# EAGLE schematic mini32 (EAGLE 7.2.0)
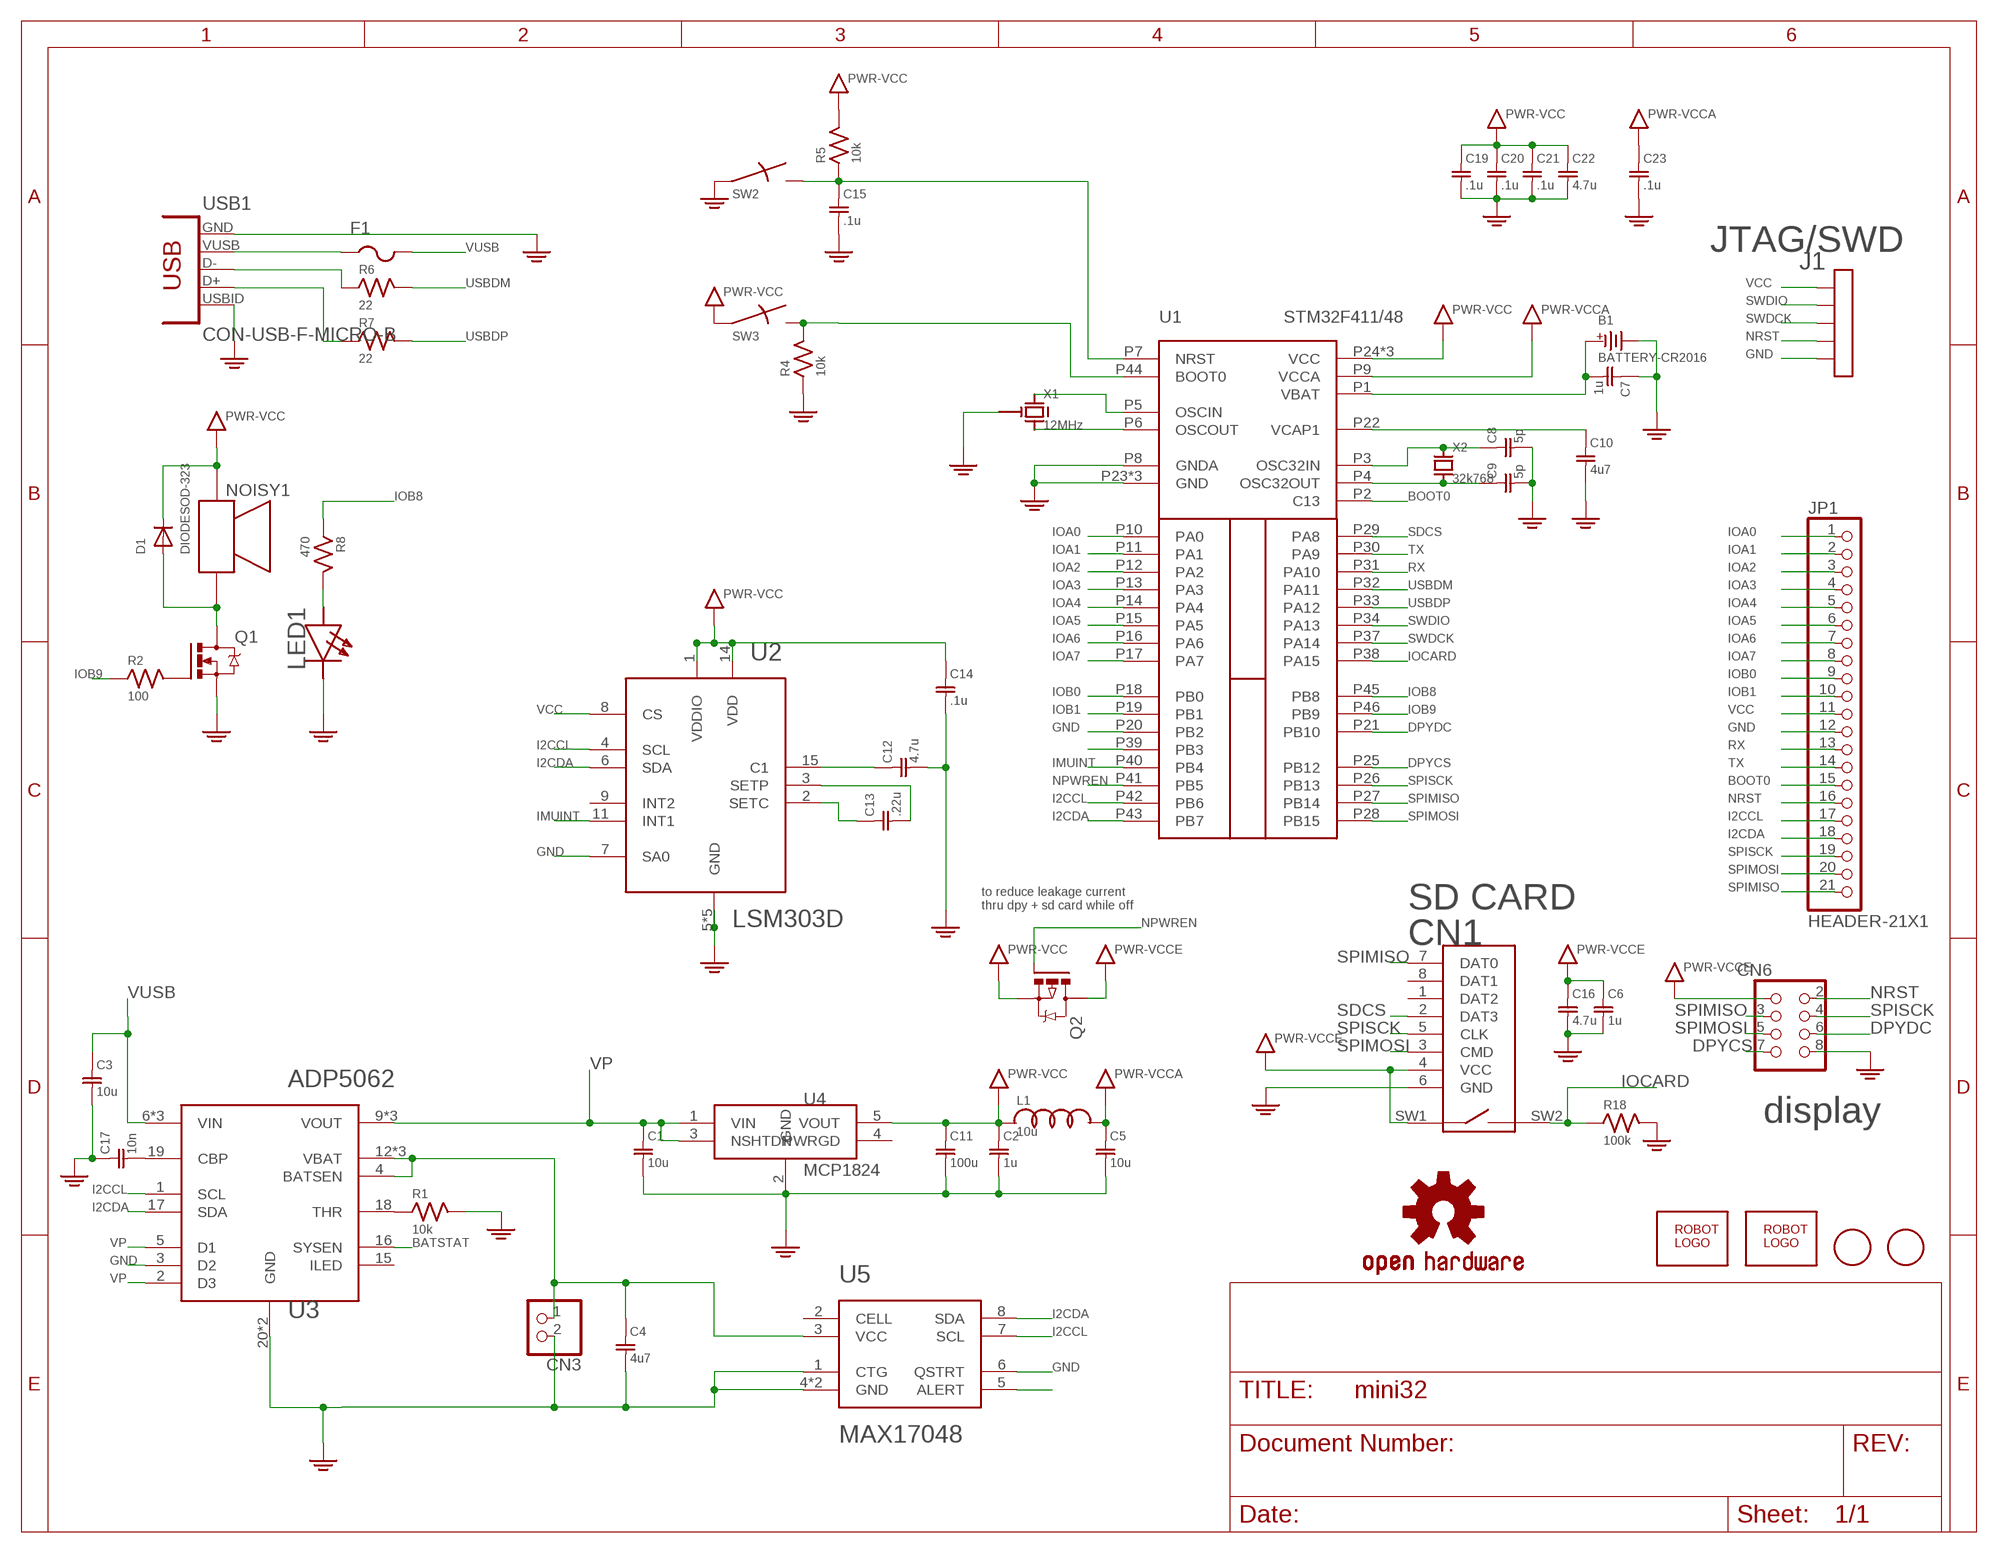
[diagram p0: schematic, sheet 1]

## Parts
B1  BATTERY-CR2016  [CR1216]
C1  10u  C0603  [SMD0603]
C2  1u  C0603  [SMD0603]
C3  10u  C0603  [SMD0603]
C4  4u7  C0603  [SMD0603]
C5  10u  C0603  [SMD0603]
C6  1u  C0603  [SMD0603]
C7  1u  C0603  [SMD0603]
C8  5p  C0603  [SMD0603]
C9  5p  C0603  [SMD0603]
C10  4u7  C0603  [SMD0603]
C11  100u  C1210  [SMD1210]
C12  4.7u  C0603  [SMD0603]
C13  .22u  C0603  [SMD0603]
C14  .1u  C0603  [SMD0603]
C15  .1u  C0603  [SMD0603]
C16  4.7u  C0603  [SMD0603]
C17  10n  C0603  [SMD0603]
C19  .1u  C0603  [SMD0603]
C20  .1u  C0603  [SMD0603]
C21  .1u  C0603  [SMD0603]
C22  4.7u  C0603  [SMD0603]
C23  .1u  C0603  [SMD0603]
CN1  MICROSDPLAIN  [MICROSD/MOLEX/FRONT/PLAIN]
CN3  JST_2PIN-SMT-RA  [JST-PH-2-SMT-RA]
CN6  HEADER-2X4  [HEADER-2X04]
D1  DIODESOD-323  [SOD-323]
F1  PTCFUSE-1206  [R1206]
J1  HEADER-5X1  [M127-5X1]
JP1  HEADER-21X1  [HEADER-21X1-PTH]
L1  10u  LSMD0603  [SMD0603]
LED1  white  LED  [SMD0603D]
LOGO1  OSHW-LOGOM  [OSHW-LOGO-M]
NOISY1  PUI-5040  [PUI-0540]
Q1  IRLML6344TRPBF  MOSFETSOT-23  [SOT-23]
Q2  DMP2035U-7  MOSFET-P  [SOT-23]
R1  10k  R0603  [SMD0603]
R2  100  R0603  [SMD0603]
R4  10k  R0603  [SMD0603]
R5  10k  R0603  [SMD0603]
R6  22  R0603  [SMD0603]
R7  22  R0603  [SMD0603]
R8  470  R0603  [SMD0603]
R18  100k  R0603  [SMD0603]
SW2  SWITCHKMR211  [KMR211]
SW3  SWITCHKMR211  [KMR211]
U1  STM32F411/48  [UQPFN48]
U2  LSM303D  [LGA16A]
U3  ADP5062  [LGA20P]
U4  MCP1824  [SOT-23-5]
U5  MAX17048  [TDFN8EP]
U$1  ROBOTMAN-LOGO2  [ROBOTMAN-LOGO2]
U$2  FIDUCIAL  [FIDUCIAL_1MM]
U$3  FIDUCIAL  [FIDUCIAL_1MM]
U$4  ROBOTMAN-LOGO2  [ROBOTMAN-LOGO2]
USB1  CON-USB-F-MICRO-B  [CONN_USB_MICRO-B]
X1  12MHz  RESONATORCTCE  [RESONATOR-CSTCE]
X2  32k768  XTAL32X15  [XTAL-32X15]

## Nets
BATSTAT: U3.16(SYSEN)
BOOT0: JP1.15 R4.2 SW3.2 SW3.4 U1.P2(C13) U1.P44(BOOT0)
DPYCS: CN6.7 U1.P25(PB12)
DPYDC: CN6.6 U1.P21(PB10)
GND: B1.MINUS(M) C1.2 C2.2 C3.2 C4.2 C5.2 C6.2 C7.1 C8.2 C9.2 C10.2 C11.2 C12.2 C14.2 C15.2 C16.2 C17.1 C19.2 C20.2 C21.2 C22.2 C23.2 CN1.6(GND) CN3.2 CN6.8 J1.P$5 JP1.12 LED1.C Q1.2(S) R1.2 R4.1 R18.2 SW2.1 SW2.3 U1.P8(GNDA) U1.P20(PB2) U1.P23(GND) U1.P35(GND) U1.P47(GND) U2.5(GND) U2.7(SA0) U2.10(GND) U2.12(GND) U2.13(GND) U2.16(GND) U3.3(D2) U3.20(GND) U3.PAD(GND) U4.2(GND) U5.1(CTG) U5.4(GND) U5.6(QSTRT) U5.PAD(GND) USB1.P4(USBID) USB1.P5(GND) X1.2(G) ; supply symbol labelled PWR-GND
I2CCL: JP1.17 U1.P42(PB6) U2.4(SCL) U3.1(SCL) U5.7(SCL)
I2CDA: JP1.18 U1.P43(PB7) U2.6(SDA) U3.17(SDA) U5.8(SDA)
IMUINT: U1.P40(PB4) U2.11(INT1)
IOA0: JP1.1 U1.P10(PA0)
IOA1: JP1.2 U1.P11(PA1)
IOA2: JP1.3 U1.P12(PA2)
IOA3: JP1.4 U1.P13(PA3)
IOA4: JP1.5 U1.P14(PA4)
IOA5: JP1.6 U1.P15(PA5)
IOA6: JP1.7 U1.P16(PA6)
IOA7: JP1.8 U1.P17(PA7)
IOB0: JP1.9 U1.P18(PB0)
IOB1: JP1.10 U1.P19(PB1)
IOB8: R8.1 U1.P45(PB8)
IOB9: R2.1 U1.P46(PB9)
IOCARD: CN1.SW2 R18.1 U1.P38(PA15)
N$1: C12.1 U2.15(C1)
N$2: C13.2 U2.3(SETP)
N$3: F1.1 USB1.P1(VUSB)
N$4: C13.1 U2.2(SETC)
N$5: C17.2 U3.19(CBP)
N$6: R1.1 U3.18(THR)
N$7: R6.1 USB1.P2(D-)
N$8: R7.1 USB1.P3(D+)
N$9: Q1.1(G) R2.2
N$11: LED1.A R8.2
N$12: U1.P5(OSCIN) X1.1(X1)
N$13: U1.P6(OSCOUT) X1.3(X2)
N$14: D1.A NOISY1.P2 Q1.3(D)
N$15: C8.1 U1.P3(OSC32IN) X2.P$1
N$16: C9.1 U1.P4(OSC32OUT) X2.P$2
N$18: C10.1 U1.P22(VCAP1)
N$21: B1.PLUS1(P) B1.PLUS2(P) C7.2 U1.P1(VBAT)
N$22: U5.5(ALERT)
NPWREN: Q2.1(G) U1.P41(PB5)
NRST: C15.1 CN6.2 J1.P$4 JP1.16 R5.1 SW2.2 SW2.4 U1.P7(NRST)
RX: JP1.13 U1.P31(PA10)
SDCS: CN1.2(DAT3) U1.P29(PA8)
SPIMISO: CN1.7(DAT0) CN6.3 JP1.21 U1.P27(PB14)
SPIMOSI: CN1.3(CMD) CN6.5 JP1.20 U1.P28(PB15)
SPISCK: CN1.5(CLK) CN6.4 JP1.19 U1.P26(PB13)
SWDCK: J1.P$3 U1.P37(PA14)
SWDIO: J1.P$2 U1.P34(PA13)
SWDWO: U1.P39(PB3)
TX: JP1.14 U1.P30(PA9)
USBDM: R6.2 U1.P32(PA11)
USBDP: R7.2 U1.P33(PA12)
VBAT: C4.1 CN3.1 U3.4(BATSEN) U3.12(VBAT) U3.13(VBAT) U3.14(VBAT) U5.3(VCC)
VCC: C2.1 C11.1 C14.1 C19.1 C20.1 C21.1 C22.1 D1.C J1.P$1 JP1.11 L1.1 NOISY1.P1 Q2.2(S) R5.2 SW3.1 SW3.3 U1.P24(VCC) U1.P36(VCC) U1.P48(VCC) U2.1(VDDIO) U2.8(CS) U2.14(VDD) U4.5(VOUT) ; supply symbol labelled PWR-VCC
VCCA: C5.1 C23.1 L1.2 U1.P9(VCCA) ; supply symbol labelled PWR-VCCA
VCCE: C6.1 C16.1 CN1.4(VCC) CN1.SW1 CN6.1 Q2.3(D) ; supply symbol labelled PWR-VCCE
VP: C1.1 U3.2(D3) U3.5(D1) U3.9(VOUT) U3.10(VOUT) U3.11(VOUT) U4.1(VIN) U4.3(NSHTDN)
VUSB: C3.1 F1.2 U3.6(VIN) U3.7(VIN) U3.8(VIN)
Unconnected: CN1.1(DAT2) CN1.8(DAT1) U2.9(INT2) U3.15(ILED) U4.4(PWRGD) U5.2(CELL) USB1.BODY@1(BODY) USB1.BODY@2(BODY) USB1.BODY@3(BODY) USB1.BODY@4(BODY)

## Notes on the sheet
- JTAG/SWD
- to reduce leakage current
  thru dpy + sd card while off
- SD CARD
- display

## Library data of the parts
B1 = jaw:BATTERY
C1-C17 C19-C23 = jaw:C
CN1 = jaw:MICROSD
CN3 = adafruit:JST_2PIN: JST 2-Pin Connectors of various flavors SMT-RA (S2B-PH-SM4) 4UConnector #17311 SMT (B2B-PH-SM4) THM-RA (S2B-PH) THM (B2B-PH)
CN6 = jaw:HEADER-2X4: PIN HEADER
D1 = jaw:DIODE
F1 = adafruit:PTCFUSE: PTC fuses, resettable thermistors
J1 = jaw:HEADER-5X1
JP1 = jaw:HEADER-21X1
L1 = jaw:L
LED1 = jaw:LED
LOGO1 = Sparkfun-Aesthetics:OSHW-LOGO: Open Source Hardware Logo This logo indicates the piece of hardware it is found on incorporates a OSHW license and/or adheres to the definition of open source hardware found here: http://freedomdefined.org/OSHW
NOISY1 = jaw:PUI-5040
Q1 = jaw:MOSFET
Q2 = jaw:MOSFET-P
R1 R2 R4-R8 R18 = jaw:R
SW2 SW3 = jaw:SWITCH
U1 = jaw:STM32F411/48
U2 = jaw:LSM303D
U3 = jaw:ADP5062
U4 = jaw:MCP1824
U5 = jaw:MAX17048
U$1 U$4 = jaw:ROBOTMAN-LOGO
U$2 U$3 = adafruit:FIDUCIAL: For use by pick and place machines to calibrate the vision/machine, 1mm By microbuilder.eu
USB1 = dp_devices:CON-USB-F: USB Female connector
X1 = jaw:RESONATOR
X2 = jaw:XTAL